# EasyEDA schematic SCH_relayboard.json
TITLE: Sheet_1; REV: 1.0; Date: 2025-12-28; Sheet: 1/1; Drawn By: aldorizky; Company: Your Company
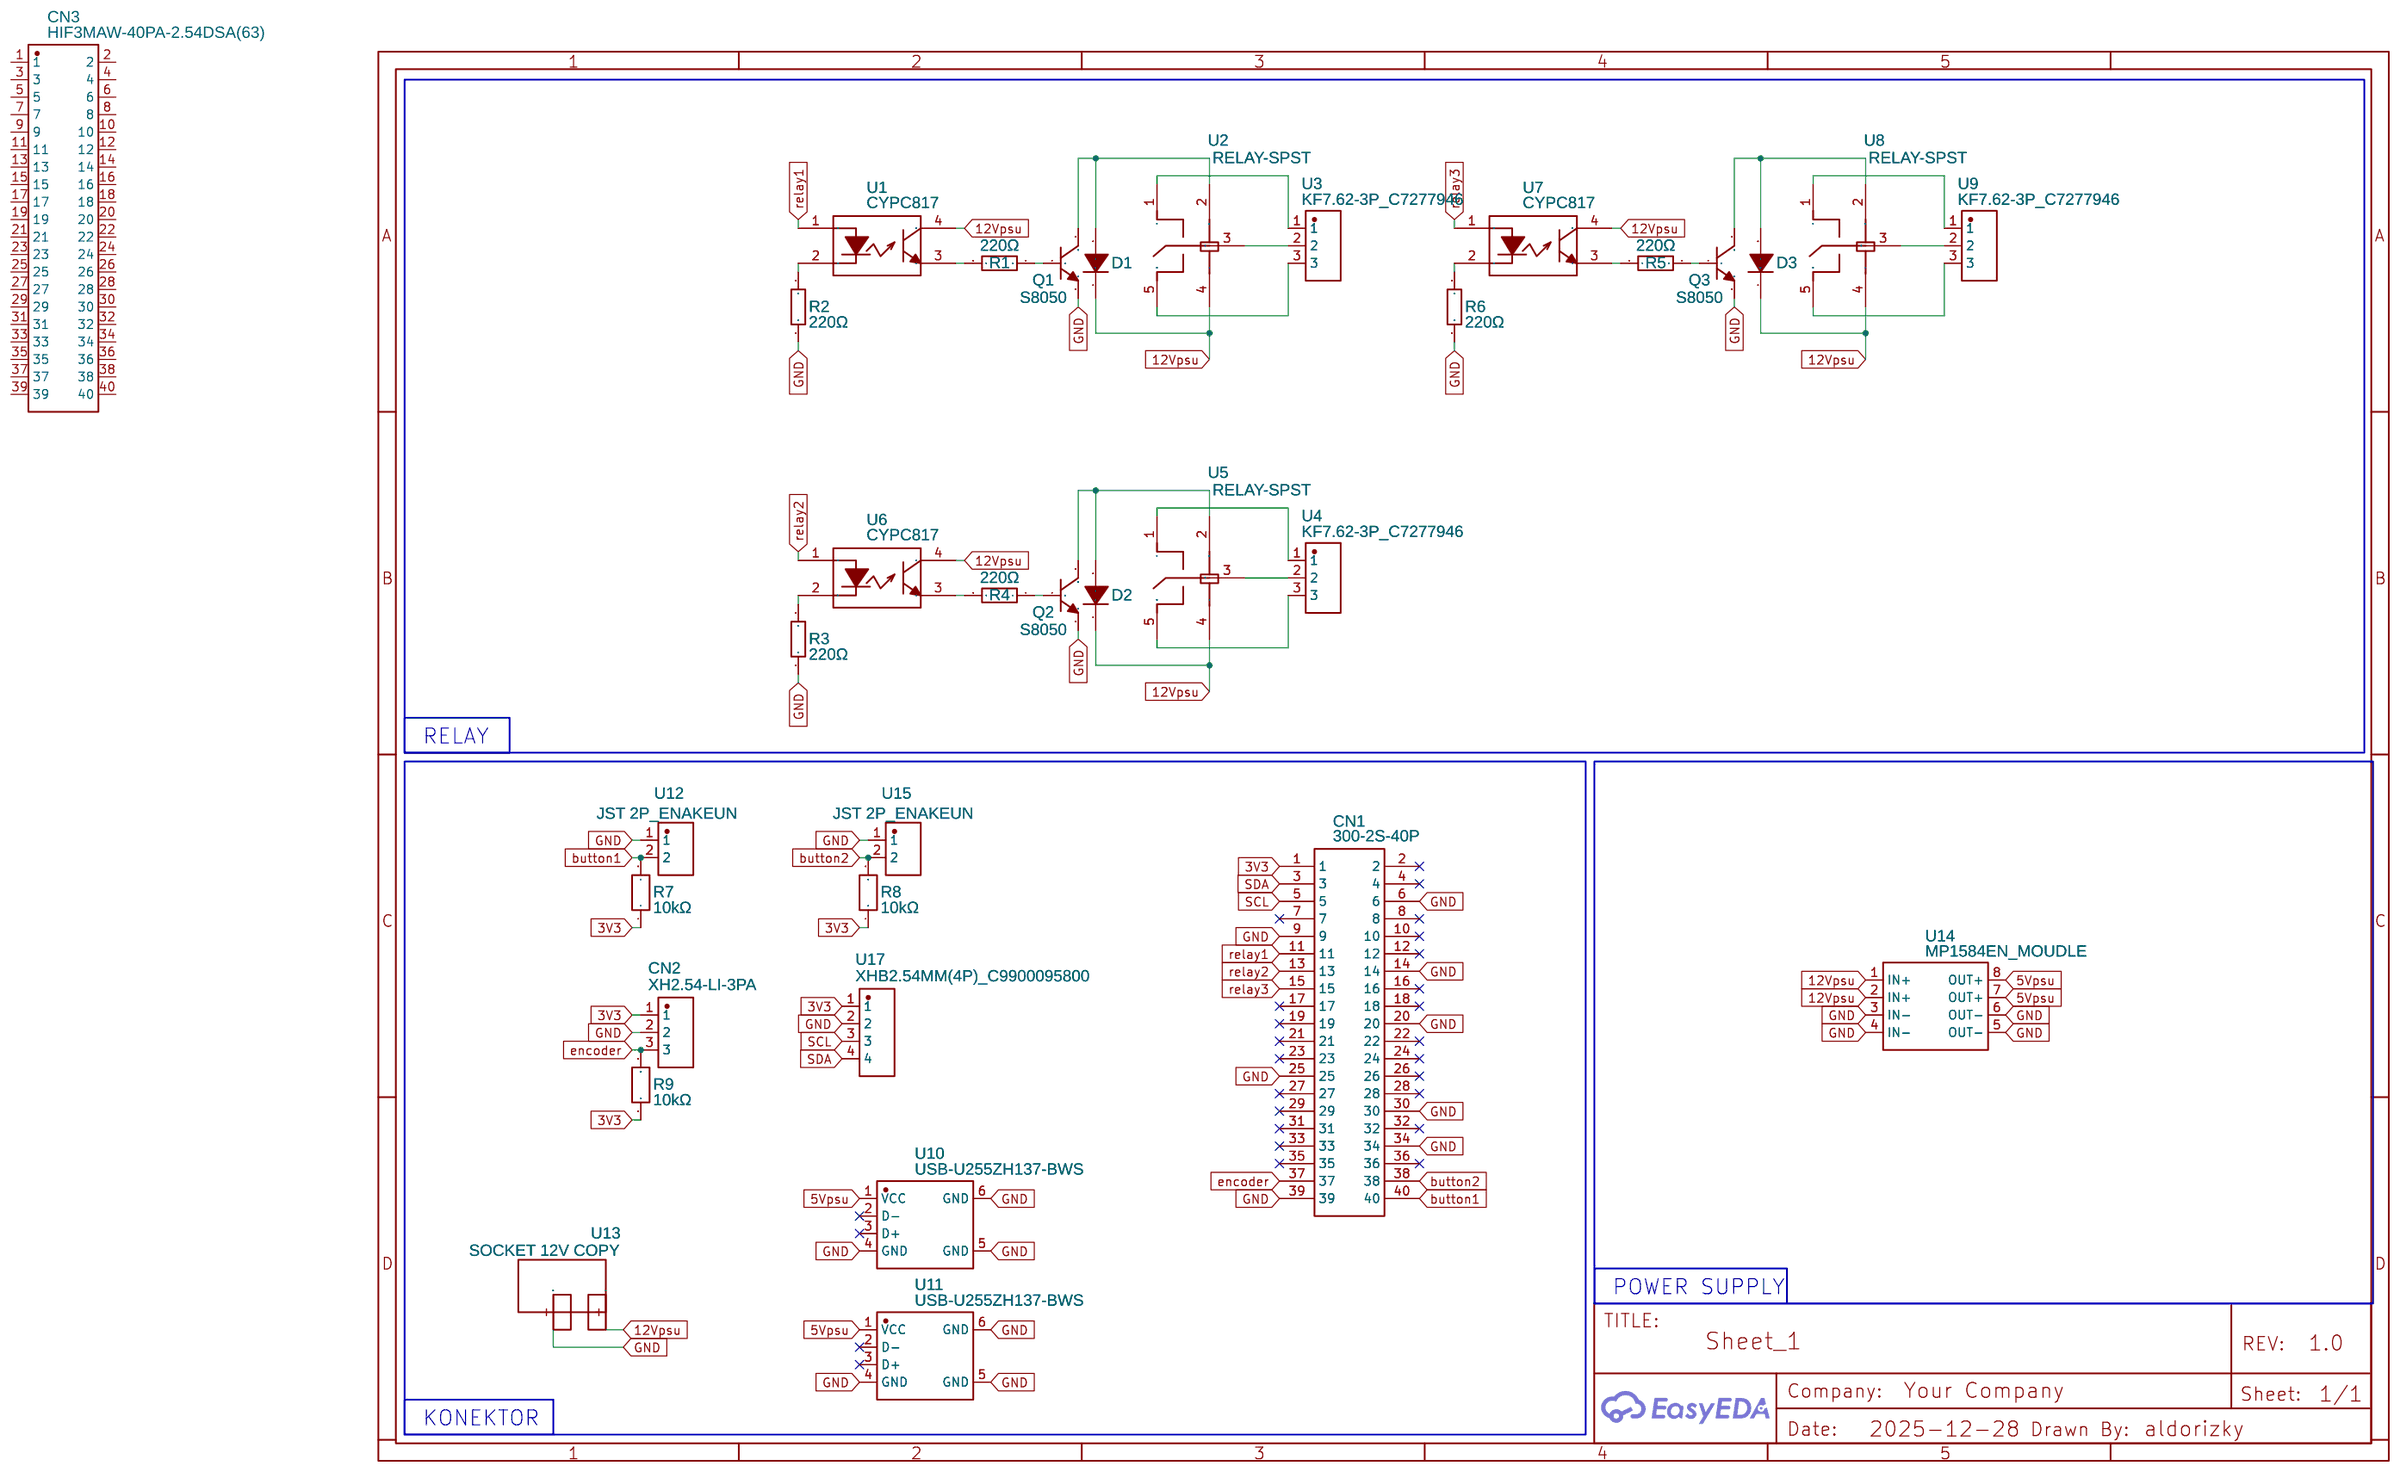
[diagram p0: schematic sheet]

## Parts
CN1  300-2S-40P  [IDC-TH_40P-P2.00_300-2S-40P]
CN2  XH2.54-LI-3PA  [CONN-TH_XH2.54-3P]
CN3  HIF3MAW-40PA-2.54DSA(63)  [IDC-TH_40P-P2.54_HDR_HIF3MAW-40PA-2.54DSA-63]
D1  1N4148WL  [SOD-123F_L2.8-W1.8-LS3.7-RD]
D2  1N4148WL  [SOD-123F_L2.8-W1.8-LS3.7-RD]
D3  1N4148WL  [SOD-123F_L2.8-W1.8-LS3.7-RD]
Q1  S8050  [SOT-23-3_L2.9-W1.3-P1.90-LS2.4]
Q2  S8050  [SOT-23-3_L2.9-W1.3-P1.90-LS2.4]
Q3  S8050  [SOT-23-3_L2.9-W1.3-P1.90-LS2.4]
R1  220Ω  [R0603]
R2  220Ω  [R0603]
R3  220Ω  [R0603]
R4  220Ω  [R0603]
R5  220Ω  [R0603]
R6  220Ω  [R0603]
R7  10kΩ  [R0603]
R8  10kΩ  [R0603]
R9  10kΩ  [R0603]
U1  CYPC817  [DIP-4_L6.4-W4.6-P2.54-LS7.6-BL]
U2  RELAY-SPST  [RELAY-TH_RELAY-SPST]
U3  KF7.62-3P_C7277946  [CONN-TH_KF7.62-3P]
U4  KF7.62-3P_C7277946  [CONN-TH_KF7.62-3P]
U5  RELAY-SPST  [RELAY-TH_RELAY-SPST]
U6  CYPC817  [DIP-4_L6.4-W4.6-P2.54-LS7.6-BL]
U7  CYPC817  [DIP-4_L6.4-W4.6-P2.54-LS7.6-BL]
U8  RELAY-SPST  [RELAY-TH_RELAY-SPST]
U9  KF7.62-3P_C7277946  [CONN-TH_KF7.62-3P]
U10  USB-U255ZH137-BWS  [USB-A-TH_USB-U255ZH137-BWS_1]
U11  USB-U255ZH137-BWS  [USB-A-TH_USB-U255ZH137-BWS_1]
U12  JST 2P_ENAKEUN  [CONN-TH_2P-P2.50-XH2.54-2P]
U13  SOCKET 12V COPY  [SOCKET12V]
U14  MP1584EN_MOUDLE  [PWRM-TH_MP1584EN_MOUDLE]
U15  JST 2P_ENAKEUN  [CONN-TH_2P-P2.50-XH2.54-2P]
U17  XHB2.54MM(4P)_C9900095800  [CONN-TH_4P-P2.50_HCTL_HC-XHB-4A]

## Library data of the parts
CN1 = 300-2S-40P: Contributor: LCSC; Supplier: LCSC; Manufacturer: Ckmtw(灿科盟); Manufacturer Part: B-3002S40P-0110; Supplier Part: C146618; JLCPCB Part Class: Extended Part
CN2 = XH2.54-LI-3PA: Contributor: lcsc; Supplier: LCSC; Supplier Part: C9900016298; Manufacturer: null; JLCPCB Part Class: Extended Part
CN3 = HIF3MAW-40PA-2.54DSA(63): Supplier: LCSC; Supplier Part: C5204774; Manufacturer: HRS(广濑); Contributor: lcsc
D1-D3 = 1N4148WL: Supplier: LCSC; Manufacturer: 晶导微电子; Supplier Part: C108804; JLCPCB Part Class: Extended Part
Q1-Q3 = S8050_C3011093: Contributor: lcsc; Supplier: LCSC; Supplier Part: C3011093; Manufacturer: JUXING(钜兴); JLCPCB Part Class: Extended Part
R1-R6 = AC0603JR-07220RL: Contributor: LCSC; Supplier: LCSC; Manufacturer: YAGEO(国巨); Supplier Part: C144616; JLCPCB Part Class: Extended Part
R7-R9 = RC0603FR-1010KL: Supplier: LCSC; Supplier Part: C4004838; Manufacturer: YAGEO(国巨); JLCPCB Part Class: Extended Part; Contributor: lcsc
U1 U6 U7 = CYPC817: Contributor: LCSC; Supplier: LCSC; Supplier Part: C385061; Manufacturer: OCIC(卓睿科); Manufacturer Part: CYPC817B; JLCPCB Part Class: Extended Part
U2 U5 U8 = RELAY-SPST: Contributor: LCSC; Supplier: LCSC; Supplier Part: C2941249; Manufacturer: null; Manufacturer Part: Relay-SPST; JLCPCB Part Class: Extended Part
U3 U4 U9 = KF7.62-3P_C7277946: Supplier: LCSC; Supplier Part: C7277946; Manufacturer: KEFA(科发); Manufacturer Part: KF7.62-3P; Contributor: lcsc
U10 U11 = USB-U255ZH137-BWS: Supplier: LCSC; Supplier Part: C6332309; Manufacturer: HANBO(汉博); Contributor: lcsc; JLCPCB Part Class: Extended Part
U12 U15 = JST 2P_ENAKEUN: Contributor: LCSC; Convert to PCB: Yes; Add into BOM: Yes; Supplier: LCSC; Supplier Part: C9900003929; Manufacturer: null; Manufacturer Part: XH-2P-2.54; JLCPCB Part Class: Extended Part
U13 = SOCKET 12V COPY: Contributor: luislevano
U14 = MP1584EN_MOUDLE: Supplier: LCSC; Supplier Part: C9900223542; Manufacturer: null; Manufacturer Part: MP1584EN_moudle; Contributor: lcsc
U17 = XHB2.54MM(4P)_C9900095800: Supplier: LCSC; Supplier Part: C9900095800; Manufacturer: null; Manufacturer Part: XHB2.54mm(4P); JLCPCB Part Class: Extended Part; Contributor: lcsc

## Nets
3V3: CN1.1 CN2.1 R7.1 R8.1 R9.1 U17.1
5Vpsu: U10.1(VCC) U11.1(VCC) U14.7(OUT+) U14.8(OUT+)
12Vpsu: D1.1(C) D2.1(C) D3.1(C) U1.4(COL) U2.4 U5.4 U6.4(COL) U7.4(COL) U8.4 U13.+(1) U14.1(IN+) U14.2(IN+)
GND: CN1.6 CN1.9 CN1.14 CN1.20 CN1.25 CN1.30 CN1.34 CN1.39 CN2.2 Q1.2(E) Q2.2(E) Q3.2(E) R2.1 R3.1 R6.1 U10.4(GND) U10.5(GND) U10.6(GND) U11.4(GND) U11.5(GND) U11.6(GND) U12.1 U13.-(2) U14.3(IN-) U14.4(IN-) U14.5(OUT-) U14.6(OUT-) U15.1 U17.2
button1: CN1.40 R7.2 U12.2
button2: CN1.38 R8.2 U15.2
encoder: CN1.37 CN2.3 R9.2
relay1: CN1.11 U1.1(AN)
relay2: CN1.13 U6.1(AN)
relay3: CN1.15 U7.1(AN)
SCL: CN1.5 U17.3
SDA: CN1.3 U17.4
Net-(D1-2): D1.2(A) Q1.3(C) U2.2
Net-(D2-2): D2.2(A) Q2.3(C) U5.2
Net-(D3-2): D3.2(A) Q3.3(C) U8.2
Net-(Q1-1): Q1.1(B) R1.1
Net-(Q2-1): Q2.1(B) R4.1
Net-(Q3-1): Q3.1(B) R5.1
Net-(R1-2): R1.2 U1.3(EM)
Net-(R2-2): R2.2 U1.2(CAT)
Net-(R3-2): R3.2 U6.2(CAT)
Net-(R4-2): R4.2 U6.3(EM)
Net-(R5-2): R5.2 U7.3(EM)
Net-(R6-2): R6.2 U7.2(CAT)
Net-(U2-1): U2.1 U3.1
Net-(U2-3): U2.3 U3.2
Net-(U2-5): U2.5 U3.3
Net-(U4-1): U4.1 U5.1
Net-(U4-2): U4.2 U5.3
Net-(U4-3): U4.3 U5.5
Net-(U8-1): U8.1 U9.1
Net-(U8-3): U8.3 U9.2
Net-(U8-5): U8.5 U9.3

Not connected (* = marked no-connect by the designer): CN1 2* 4* 7* 8* 10* 12* 16* 17* 18* 19* 21* 22* 23* 24* 26* 27* 28* 29* 31* 32* 33* 35* 36*; CN3 1 2 3 4 5 6 7 8 9 10 11 12 13 14 15 16 17 18 19 20 21 22 23 24 25 26 27 28 29 30 31 32 33 34 35 36 37 38 39 40; U10 2(D-)* 3(D+)*; U11 2(D-)* 3(D+)*

## Notes on the sheet
- RELAY
- POWER SUPPLY
- KONEKTOR
